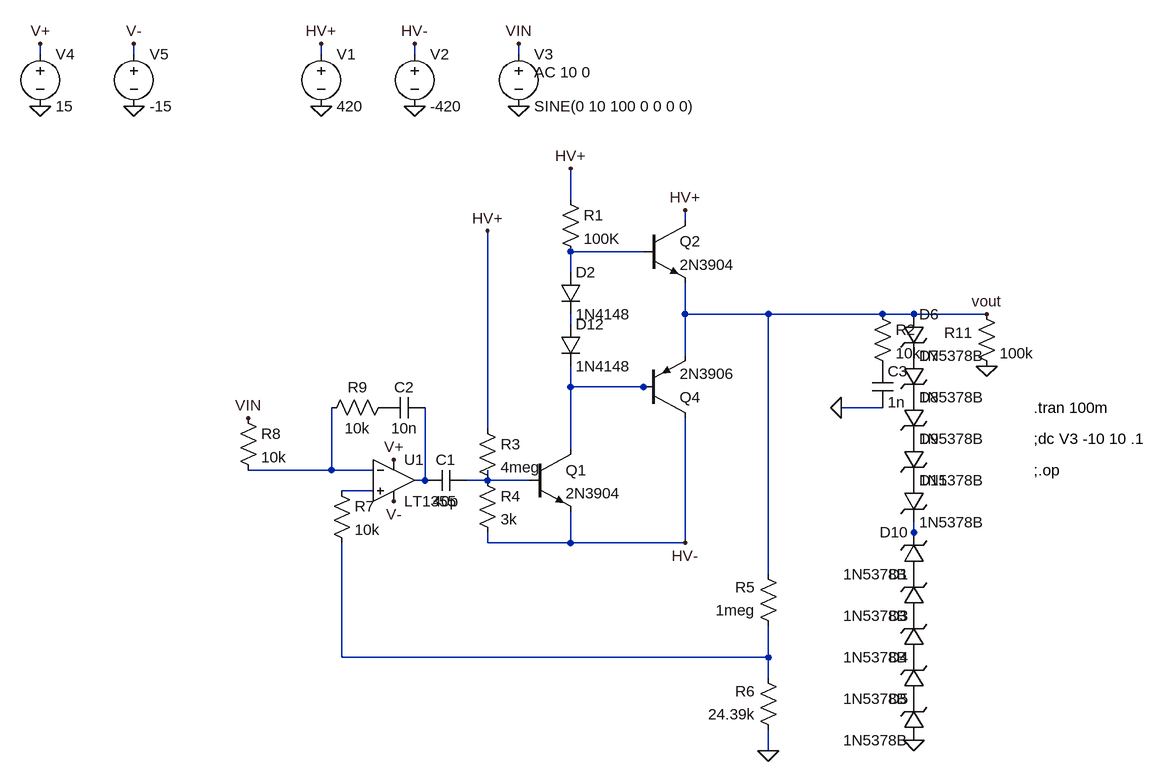
[diagram p0: schematic Draft13.asc]
Draft13.asc, the LTspice schematic file:
Version 4
SHEET 1 1184 932
WIRE -544 -208 -544 -224
WIRE -400 -208 -400 -224
WIRE -112 -208 -112 -224
WIRE 32 -208 32 -224
WIRE 192 -208 192 -224
WIRE 272 16 272 -32
WIRE 448 48 448 32
WIRE 384 96 272 96
WIRE 272 128 272 96
WIRE 448 192 448 144
WIRE 576 192 448 192
WIRE 752 192 576 192
WIRE 800 192 752 192
WIRE 912 192 800 192
WIRE 272 208 272 192
WIRE 448 256 448 192
WIRE 272 304 272 272
WIRE 384 304 272 304
WIRE 400 304 384 304
WIRE 752 336 688 336
WIRE 144 368 144 64
WIRE 272 400 272 304
WIRE -96 432 -96 336
WIRE -96 432 -224 432
WIRE -32 432 -96 432
WIRE 48 448 48 336
WIRE 48 448 32 448
WIRE 64 448 48 448
WIRE 144 448 144 432
WIRE 144 448 112 448
WIRE 208 448 144 448
WIRE -32 464 -80 464
WIRE 800 528 800 512
WIRE 144 544 144 528
WIRE 272 544 272 496
WIRE 272 544 144 544
WIRE 448 544 448 352
WIRE 448 544 272 544
WIRE 800 544 800 528
WIRE 576 592 576 192
WIRE -80 720 -80 544
WIRE 576 720 576 672
WIRE 576 720 -80 720
WIRE 576 752 576 720
WIRE 576 864 576 832
FLAG -112 -128 0
FLAG 32 -128 0
FLAG 192 -128 0
FLAG -112 -224 HV+
FLAG 32 -224 HV-
FLAG 192 -224 VIN
FLAG 448 32 HV+
FLAG -544 -128 0
FLAG -400 -128 0
FLAG -544 -224 V+
FLAG -400 -224 V-
FLAG 0 416 V+
FLAG 0 480 V-
FLAG 576 864 0
FLAG 688 336 0
FLAG 912 192 vout
FLAG 912 272 0
FLAG 800 848 0
FLAG 448 544 HV-
FLAG 272 -32 HV+
FLAG 144 64 HV+
FLAG -224 352 VIN
SYMBOL voltage -112 -224 R0
WINDOW 123 0 0 Left 2
WINDOW 39 0 0 Left 2
SYMATTR InstName V1
SYMATTR Value 420
SYMBOL voltage 32 -224 R0
WINDOW 123 0 0 Left 2
WINDOW 39 0 0 Left 2
SYMATTR InstName V2
SYMATTR Value -420
SYMBOL voltage 192 -224 R0
WINDOW 123 24 44 Left 2
WINDOW 39 0 0 Left 2
SYMATTR Value2 AC 10 0
SYMATTR InstName V3
SYMATTR Value SINE(0 10 100 0 0 0 0)
SYMBOL voltage -544 -224 R0
WINDOW 123 0 0 Left 2
WINDOW 39 0 0 Left 2
SYMATTR InstName V4
SYMATTR Value 15
SYMBOL voltage -400 -224 R0
WINDOW 123 0 0 Left 2
WINDOW 39 0 0 Left 2
SYMATTR InstName V5
SYMATTR Value -15
SYMBOL Opamps\\LT1355 0 384 R0
SYMATTR InstName U1
SYMBOL res 592 688 R180
WINDOW 0 36 76 Left 2
WINDOW 3 36 40 Left 2
SYMATTR InstName R5
SYMATTR Value 1meg
SYMBOL res 592 848 R180
WINDOW 0 36 76 Left 2
WINDOW 3 36 40 Left 2
SYMATTR InstName R6
SYMATTR Value 24.39k
SYMBOL res 736 176 R0
SYMATTR InstName R2
SYMATTR Value 10k
SYMBOL cap 736 272 R0
SYMATTR InstName C3
SYMATTR Value 1n
SYMBOL res 896 176 R0
WINDOW 0 -49 45 Left 2
SYMATTR InstName R11
SYMATTR Value 100k
SYMBOL zener 784 192 R0
SYMATTR InstName D6
SYMATTR Value 1N5378B
SYMATTR Description Diode
SYMATTR Type diode
SYMBOL zener 784 256 R0
SYMATTR InstName D7
SYMATTR Value 1N5378B
SYMATTR Description Diode
SYMATTR Type diode
SYMBOL zener 784 320 R0
SYMATTR InstName D8
SYMATTR Value 1N5378B
SYMATTR Description Diode
SYMATTR Type diode
SYMBOL zener 784 384 R0
SYMATTR InstName D9
SYMATTR Value 1N5378B
SYMATTR Description Diode
SYMATTR Type diode
SYMBOL zener 816 656 R180
WINDOW 0 24 64 Left 2
WINDOW 3 24 0 Left 2
SYMATTR InstName D1
SYMATTR Value 1N5378B
SYMATTR Description Diode
SYMATTR Type diode
SYMBOL zener 816 720 R180
WINDOW 0 24 64 Left 2
WINDOW 3 24 0 Left 2
SYMATTR InstName D3
SYMATTR Value 1N5378B
SYMATTR Description Diode
SYMATTR Type diode
SYMBOL zener 816 784 R180
WINDOW 0 24 64 Left 2
WINDOW 3 24 0 Left 2
SYMATTR InstName D4
SYMATTR Value 1N5378B
SYMATTR Description Diode
SYMATTR Type diode
SYMBOL zener 816 848 R180
WINDOW 0 24 64 Left 2
WINDOW 3 24 0 Left 2
SYMATTR InstName D5
SYMATTR Value 1N5378B
SYMATTR Description Diode
SYMATTR Type diode
SYMBOL zener 816 592 R180
WINDOW 0 24 64 Left 2
WINDOW 3 24 0 Left 2
SYMATTR InstName D10
SYMATTR Value 1N5378B
SYMATTR Description Diode
SYMATTR Type diode
SYMBOL zener 784 448 R0
SYMATTR InstName D11
SYMATTR Value 1N5378B
SYMATTR Description Diode
SYMATTR Type diode
SYMBOL npn 208 400 R0
SYMATTR InstName Q1
SYMATTR Value 2N3904
SYMBOL diode 256 128 R0
SYMATTR InstName D2
SYMATTR Value 1N4148
SYMBOL diode 256 208 R0
SYMATTR InstName D12
SYMATTR Value 1N4148
SYMBOL res 256 0 R0
SYMATTR InstName R1
SYMATTR Value 100K
SYMBOL res 128 352 R0
SYMATTR InstName R3
SYMATTR Value 4meg
SYMBOL res 128 432 R0
SYMATTR InstName R4
SYMATTR Value 3k
SYMBOL cap 112 432 R90
WINDOW 0 0 32 VBottom 2
WINDOW 3 32 32 VTop 2
SYMATTR InstName C1
SYMATTR Value 40p
SYMBOL npn 384 48 R0
SYMATTR InstName Q2
SYMATTR Value 2N3904
SYMBOL res -96 448 R0
SYMATTR InstName R7
SYMATTR Value 10k
SYMBOL res -240 336 R0
SYMATTR InstName R8
SYMATTR Value 10k
SYMBOL res 0 320 R90
WINDOW 0 0 56 VBottom 2
WINDOW 3 32 56 VTop 2
SYMATTR InstName R9
SYMATTR Value 10k
SYMBOL cap 48 320 R90
WINDOW 0 0 32 VBottom 2
WINDOW 3 32 32 VTop 2
SYMATTR InstName C2
SYMATTR Value 10n
SYMBOL pnp 384 352 M180
SYMATTR InstName Q4
SYMATTR Value 2N3906
TEXT 984 384 Left 2 !;dc V3 -10 10 .1
TEXT 984 336 Left 2 !.tran 100m
TEXT 984 432 Left 2 !;.op

The netlist it stands for:
* Draft13.asc
V1 HV+ 0 420
V2 HV- 0 -420
V3 VIN 0 SINE(0 10 100 0 0 0 0) AC 10 0
V4 V+ 0 15
V5 V- 0 -15
XU1 N007 N004 V+ V- N005 LT1355  ; pins In+ In- V+ V- OUT
R5 N009 vout 1meg
R6 0 N009 24.39k
R2 vout P001 10k
C3 P001 0 1n
R11 vout 0 100k
D6 vout P002 1N5378B
D7 P002 P003 1N5378B
D8 P003 P004 1N5378B
D9 P004 P005 1N5378B
D1 P006 P007 1N5378B
D3 P008 P006 1N5378B
D4 P009 P008 1N5378B
D5 0 P009 1N5378B
D10 P007 N008 1N5378B
D11 P005 N008 1N5378B
Q1 N003 N006 HV- 0 2N3904
D2 N001 N002 1N4148
D12 N002 N003 1N4148
R1 HV+ N001 100K
R3 HV+ N006 4meg
R4 N006 HV- 3k
C1 N006 N005 40p
Q2 HV+ N001 vout 0 2N3904
R7 N007 N009 10k
R8 VIN N004 10k
R9 P010 N004 10k
C2 N005 P010 10n
Q4 HV- N003 vout 0 2N3906
.model D D
.lib standard.dio
.model NPN NPN
.model PNP PNP
.lib standard.bjt
;dc V3 -10 10 .1
.tran 100m
;.op
.backanno
.end